# EAGLE design RpiXBeeDaughter (EAGLE 6.4)
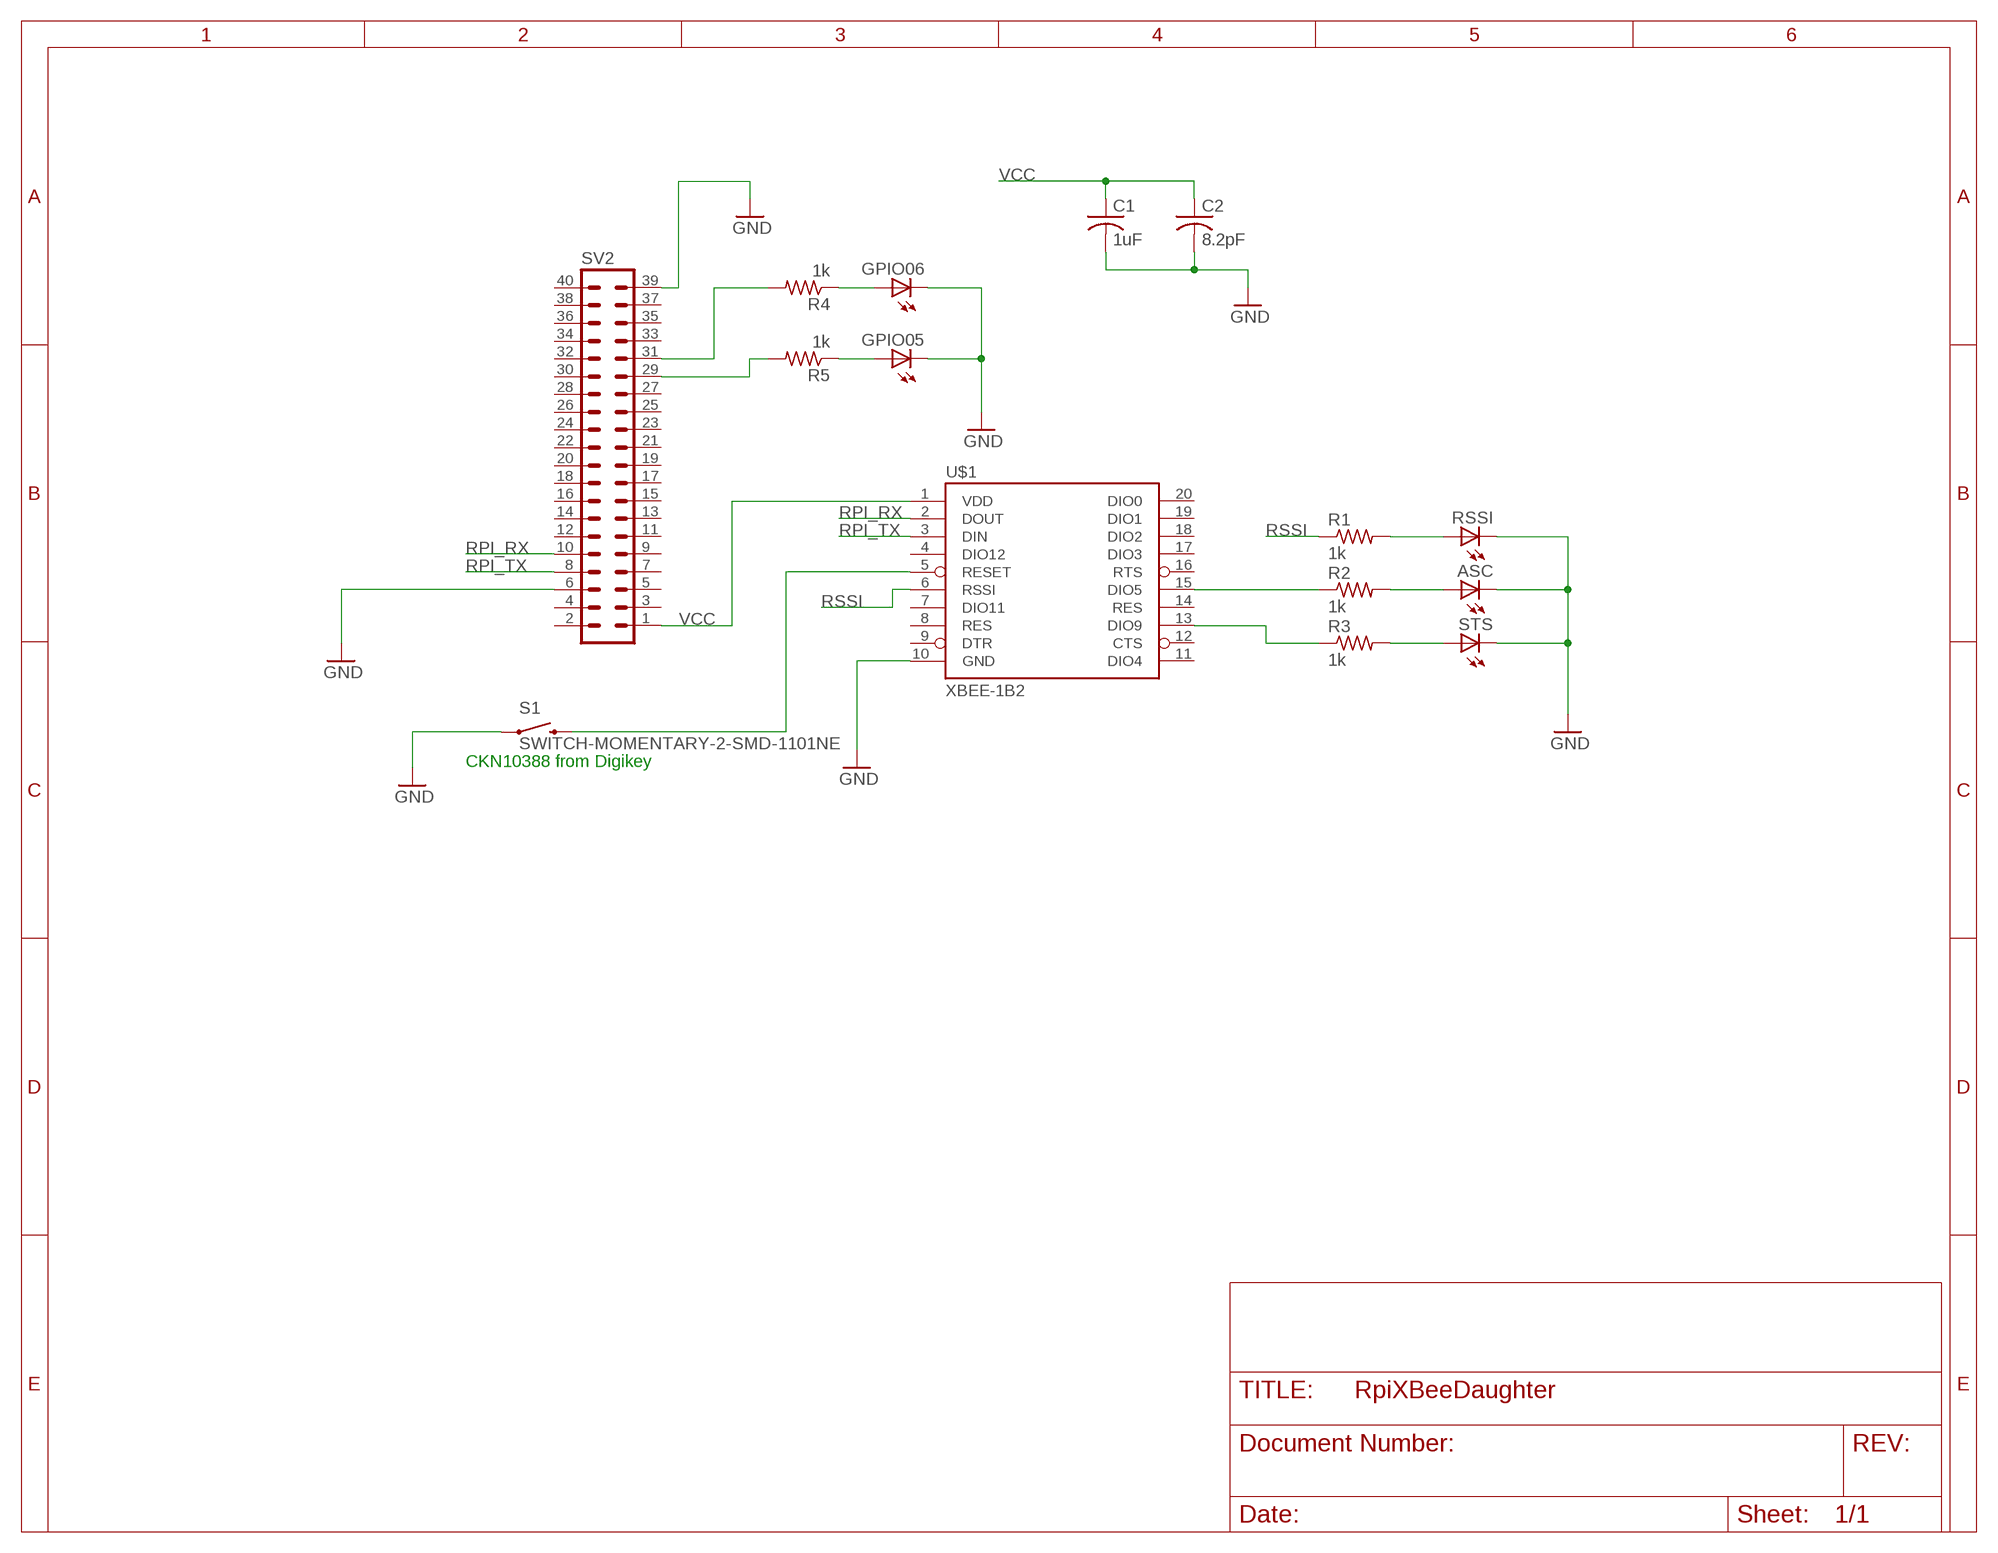
[diagram p0: schematic, sheet 1]

## Parts
ASC  LEDCHIP-LED0603  [CHIP-LED0603]
C1  1uF  C-USC0805  [C0805]
C2  8.2pF  C-USC0603  [C0603]
GPIO05  LEDCHIP-LED0603  [CHIP-LED0603]
GPIO06  LEDCHIP-LED0603  [CHIP-LED0603]
R1  1k  R-US_R0603  [R0603]
R2  1k  R-US_R0603  [R0603]
R3  1k  R-US_R0603  [R0603]
R4  1k  R-US_R0603  [R0603]
R5  1k  R-US_R0603  [R0603]
RSSI  LEDCHIP-LED0603  [CHIP-LED0603]
S1  SWITCH-MOMENTARY-2-SMD-1101NE  [TACTILE-SWITCH-1101NE]
STS  LEDCHIP-LED0603  [CHIP-LED0603]
SV2  MA20-2  [MA20-2]
U$1  XBEE-1B2  [XBEE-SILK]

## Nets
GND [GND]: ASC.C C1.2 C2.2 GPIO05.C GPIO06.C RSSI.C S1.P$1 STS.C SV2.6 SV2.39 U$1.10(GND)
N$1: S1.P$2 U$1.5(RESET)
N$2: R3.2 STS.A
N$3: R2.1 U$1.15(DIO5)
N$4: R1.2 RSSI.A
N$5: ASC.A R2.2
N$6: R3.1 U$1.13(DIO9)
N$7: R4.2 SV2.31
N$8: GPIO06.A R4.1
N$10: R5.2 SV2.29
N$11: GPIO05.A R5.1
RPI_RX: SV2.10 U$1.2(DOUT)
RPI_TX: SV2.8 U$1.3(DIN)
RSSI: R1.1 U$1.6(RSSI)
VCC [VCC]: C1.1 C2.1 SV2.1 U$1.1(VDD)
Unconnected: SV2.2 SV2.3 SV2.4 SV2.5 SV2.7 SV2.9 SV2.11 SV2.12 SV2.13 SV2.14 SV2.15 SV2.16 SV2.17 SV2.18 SV2.19 SV2.20 SV2.21 SV2.22 SV2.23 SV2.24 SV2.25 SV2.26 SV2.27 SV2.28 SV2.30 SV2.32 SV2.33 SV2.34 SV2.35 SV2.36 SV2.37 SV2.38 SV2.40 U$1.4(DIO12) U$1.7(DIO11) U$1.8(RES) U$1.9(DTR) U$1.11(DIO4) U$1.12(CTS) U$1.14(RES) U$1.16(RTS) U$1.17(DIO3) U$1.18(DIO2) U$1.19(DIO1) U$1.20(DIO0)

## Notes on the sheet
- CKN10388 from Digikey

## Library data of the parts
ASC GPIO05 GPIO06 RSSI STS = led:LED: LED OSRAM: - CHIPLED LG R971, LG N971, LY N971, LG Q971, LY Q971, LO R971, LY R971 LH N974, LH R974 LS Q976, LO Q976, LY Q976 LO Q996 - Hyper CHIPLED LW Q18S LB Q993, LB Q99A, LB R99A - SideLED LS A670, LO A670, LY A670, LG A670, LP A670 LB A673, LV A673, LT A673, LW A673 LH A674 LY A675 LS A676, LA A676, LO A676, LY A676, LW A676 LS A679, LY A679, LG A679 - Hyper Micro SIDELED® LS Y876, LA Y876, LO Y876, LY Y876 LT Y87S - SmartLED LW L88C, LW L88S LB L89C, LB L89S, LG L890 LS L89K, LO L89K, LY L89K LS L896, LA L896, LO L896, LY L896 - TOPLED LS T670, LO T670, LY T670, LG T670, LP T670 LSG T670, LSP T670, LSY T670, LOP T670, LYG T670 LG T671, LOG T671, LSG T671 LB T673, LV T673, LT T673, LW T673 LH T674 LS T676, LA T676, LO T676, LY T676, LB T676, LH T676, LSB T676, LW T676 LB T67C, LV T67C, LT T67C, LS T67K, LO T67K, LY T67K, LW E67C LS E67B, LA E67B, LO E67B, LY E67B, LB E67C, LV E67C, LT E67C LW T67C LS T679, LY T679, LG T679 LS T770, LO T770, LY T770, LG T770, LP T770 LB T773, LV T773, LT T773, LW T773 LH T774 LS E675, LA E675, LY E675, LS T675 LS T776, LA T776, LO T776, LY T776, LB T776 LHGB T686 LT T68C, LB T68C - Hyper Mini TOPLED® LB M676 - Mini TOPLED Santana® LG M470 LS M47K, LO M47K, LY M47K Source: http://www.osram.convergy.de LUXEON: - LUMILED® LXK2-PW12-R00, LXK2-PW12-S00, LXK2-PW14-U00, LXK2-PW14-V00 LXK2-PM12-R00, LXK2-PM12-S00, LXK2-PM14-U00 LXK2-PE12-Q00, LXK2-PE12-R00, LXK2-PE12-S00, LXK2-PE14-T00, LXK2-PE14-U00 LXK2-PB12-K00, LXK2-PB12-L00, LXK2-PB12-M00, LXK2-PB14-N00, LXK2-PB14-P00, LXK2-PB14-Q00 LXK2-PR12-L00, LXK2-PR12-M00, LXK2-PR14-Q00, LXK2-PR14-R00 LXK2-PD12-Q00, LXK2-PD12-R00, LXK2-PD12-S00 LXK2-PH12-R00, LXK2-PH12-S00 LXK2-PL12-P00, LXK2-PL12-Q00, LXK2-PL12-R00 Source: www.luxeon.com KINGBRIGHT: KA-3528ASYC Source: www.kingbright.com
C1 C2 = rcl:C-US: CAPACITOR, American symbol
R1-R5 = resistor:R-US_: RESISTOR, American symbol
S1 = SparkFun-Electromechanical:SWITCH-MOMENTARY-2: Various NO switches- pushbuttons, reed, etc
SV2 = con-lstb:MA20-2: PIN HEADER; OC_FARNELL: unknown; OC_NEWARK: unknown
U$1 = SparkFun-RF:XBEE-1: Xbee module footprints SMT header is CONN-09042.

## Net classes
1 GND: width 0.508 mm
2 VCC: width 0.508 mm

## Board
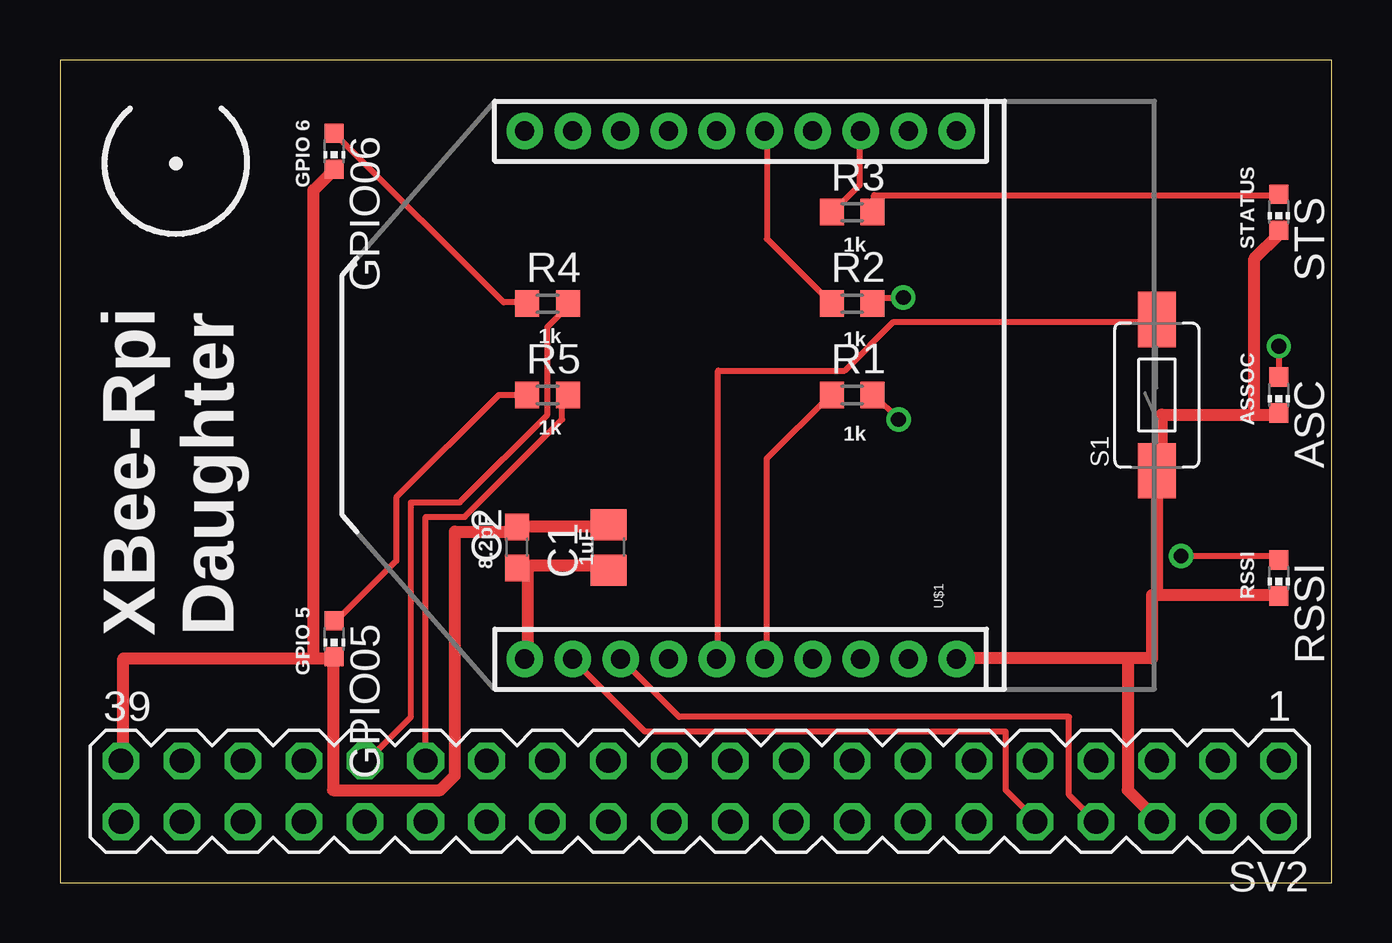
[diagram p1: board, top side]
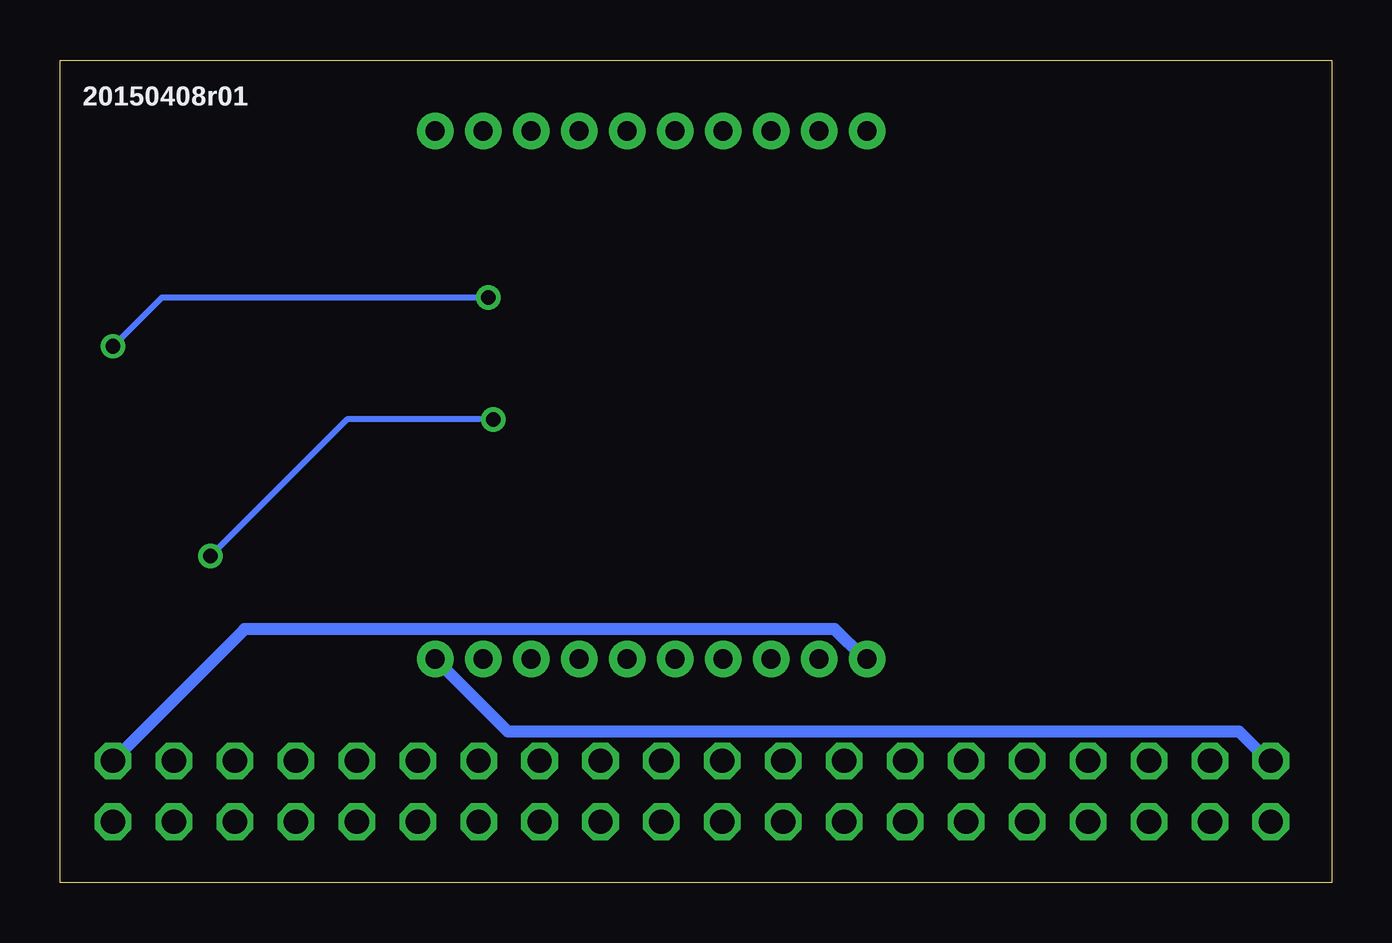
[diagram p2: board, bottom side, seen from below]

Size 53.01 x 34.28 mm. Coordinates in mm from the lower left corner, seen from the top.
Outline: 0,0 53.01,0 53.01,34.28 0,34.28 0,0
Copper layers (1*16): Top 0.035mm / dielectric 1.5mm / Bottom 0.035mm
Design rules "default *": minimum track width 10mil, minimum drill 24mil, track to track 8mil, track to pad 8mil, pad to pad 8mil, via to via 8mil, smd to smd 8mil, copper to edge 40mil, drill to drill 8mil, minimum pad ring 10mil, minimum via ring 8mil, stop-mask expansion 4mil, vias tented up to drill 25mil, thermal gap 10mil

### Footprints (pad centres in the part's own frame; a part is rotated, then mirrored left to right if it is on the bottom)
CHIP-LED0603 = smd 0.8 x 0.8: A 0,-0.75; C 0,0.75
C0805 = smd 1.3 x 1.5: 1 -0.95,0; 2 0.95,0
C0603 = smd 1.1 x 1: 1 -0.85,0; 2 0.85,0
R0603 = smd 1 x 1.1: 1 -0.85,0; 2 0.85,0
TACTILE-SWITCH-1101NE = smd 2.3 x 1.6: P$1 -3.15,0; P$2 3.15,0
MA20-2 = drill 1.016 octagon: 1 -24.13,-1.27; 2 -24.13,1.27; 3 -21.59,-1.27; 4 -21.59,1.27; 5 -19.05,-1.27; 6 -19.05,1.27; 7 -16.51,-1.27; 8 -16.51,1.27; 9 -13.97,-1.27; 10 -13.97,1.27; 11 -11.43,-1.27; 12 -11.43,1.27; 13 -8.89,-1.27; 14 -8.89,1.27; 15 -6.35,-1.27; 16 -6.35,1.27; 17 -3.81,-1.27; 18 -3.81,1.27; 19 -1.27,-1.27; 20 -1.27,1.27; 21 1.27,-1.27; 22 1.27,1.27; 23 3.81,-1.27; 24 3.81,1.27; 25 6.35,-1.27; 26 6.35,1.27; 27 8.89,-1.27; 28 8.89,1.27; 29 11.43,-1.27; 30 11.43,1.27; 31 13.97,-1.27; 32 13.97,1.27; 33 16.51,-1.27; 34 16.51,1.27; 35 19.05,-1.27; 36 19.05,1.27; 37 21.59,-1.27; 38 21.59,1.27; 39 24.13,-1.27; 40 24.13,1.27
XBEE-SILK = drill 0.8 pad 1.524: 1 -11,20; 2 -11,18; 3 -11,16; 4 -11,14; 5 -11,12; 6 -11,10; 7 -11,8; 8 -11,6; 9 -11,4; 10 -11,2; 11 11,2; 12 11,4; 13 11,6; 14 11,8; 15 11,10; 16 11,12; 17 11,14; 18 11,16; 19 11,18; 20 11,20

### Placement (x,y rotation side)
ASC  50.8,20.32 180 top
C1  22.86,13.97 90 top
C2  19.05,13.97 90 top
GPIO05  11.43,10.16 180 top
GPIO06  11.43,30.48 180 top
R1  33.02,20.32 0 top
R2  33.02,24.13 0 top
R3  33.02,27.94 0 top
R4  20.32,24.13 0 top
R5  20.32,20.32 0 top
RSSI  50.8,12.7 180 top
S1  45.72,20.32 90 top
STS  50.8,27.94 180 top
SV2  26.67,3.81 180 top
U$1  39.37,20.32 90 top

### Tracks (layer width: path | path; a pad name or v marks a point on that pad's centre or on a via)
GND
  Top 0.508: 45.72,11.99 50.8,11.99 RSSI.C | 45.72,11.99 S1.P$1 45.92,17.27 45.92,19.51 49.78,19.51 | 49.78,19.51 50.8,19.51 ASC.C | 49.78,19.51 49.78,26.01 50.8,27.03 STS.C | 44.5,9.35 45.52,9.35 45.52,11.99 45.72,11.99 | 44.5,9.35 37.39,9.35 U$1.10 | 44.5,9.35 44.5,3.86 45.72,2.64 SV2.6 | C1.2 22.76,14.83 19.1,14.83 C2.2 18.9,14.63 16.46,14.63 16.46,4.47 15.85,3.86 11.38,3.86 11.38,9.14 GPIO05.C 11.38,9.35 10.57,9.35 | 10.57,9.35 2.64,9.35 2.64,5.08 SV2.39 | 10.57,9.35 10.57,28.85 11.38,29.67 GPIO06.C
  Bottom 0.508: U$1.10 37.19,9.14 34.34,6.3 3.86,6.3 2.64,5.08 SV2.39
N$1
  Top 0.254: S1.P$2 45.72,23.37 34.75,23.37 32.72,21.34 27.43,21.34 27.43,9.35 U$1.5
N$2
  Top 0.254: STS.A 50.8,28.65 33.93,28.65 33.93,28.04 R3.2
N$3
  Top 0.254: R2.1 32.11,24.18 29.46,26.82 29.46,31.29 U$1.15
N$4  (via drill 0.61)
  Top 0.254: v46.74,13.61 50.8,13.61 RSSI.A | v34.95,19.3 33.93,20.32 R1.2
  Bottom 0.254: v46.74,13.61 41.05,19.3 v34.95,19.3
N$5  (via drill 0.61)
  Top 0.254: v50.8,22.35 ASC.A | v35.15,24.38 33.93,24.38 33.93,24.18 R2.2
  Bottom 0.254: v50.8,22.35 48.77,24.38 v35.15,24.38
N$6
  Top 0.254: R3.1 32.31,28.04 33.33,29.06 33.33,31.29 U$1.13
N$7
  Top 0.254: R4.2 21.13,23.98 20.32,23.16 20.32,19.51 16.66,15.85 14.63,15.85 14.63,6.91 12.8,5.08 SV2.31
N$8
  Top 0.254: GPIO06.A 11.58,31.09 18.49,24.18 19.3,24.18 R4.1
N$10
  Top 0.254: SV2.29 15.24,15.24 16.87,15.24 20.93,19.3 20.93,20.12 21.13,20.32 R5.2
N$11
  Top 0.254: R5.1 18.29,20.32 14.02,16.05 14.02,13.41 11.58,10.97 GPIO05.A
RPI_RX
  Top 0.254: U$1.2 21.54,9.14 24.38,6.3 39.42,6.3 39.42,3.86 40.64,2.64 SV2.10
RPI_TX
  Top 0.254: SV2.8 42.06,3.66 42.06,6.91 25.81,6.91 23.57,9.14 U$1.3
RSSI
  Top 0.254: R1.1 32.11,20.32 29.46,17.68 29.46,9.35 U$1.6
VCC
  Top 0.508: C1.1 22.76,13.21 19.1,13.21 C2.1 19.51,13.01 19.51,9.35 U$1.1
  Bottom 0.508: SV2.1 45.31,10.57 20.73,10.57 19.51,9.35 U$1.1

### Text on the board
Bottom: 20150408r01
tPlace: GPIO 6 | 1k | STATUS | 1k | 1k | 1k | ASSOC | 1k | 8.2pF | 1uF | RSSI | XBee-Rpi / Daughter | GPIO 5
bPlace: 20150408r01